# EAGLE design 4StringDriver (EAGLE 7.5.0)
DESIGNER: Ross; VERSION: 1.0a
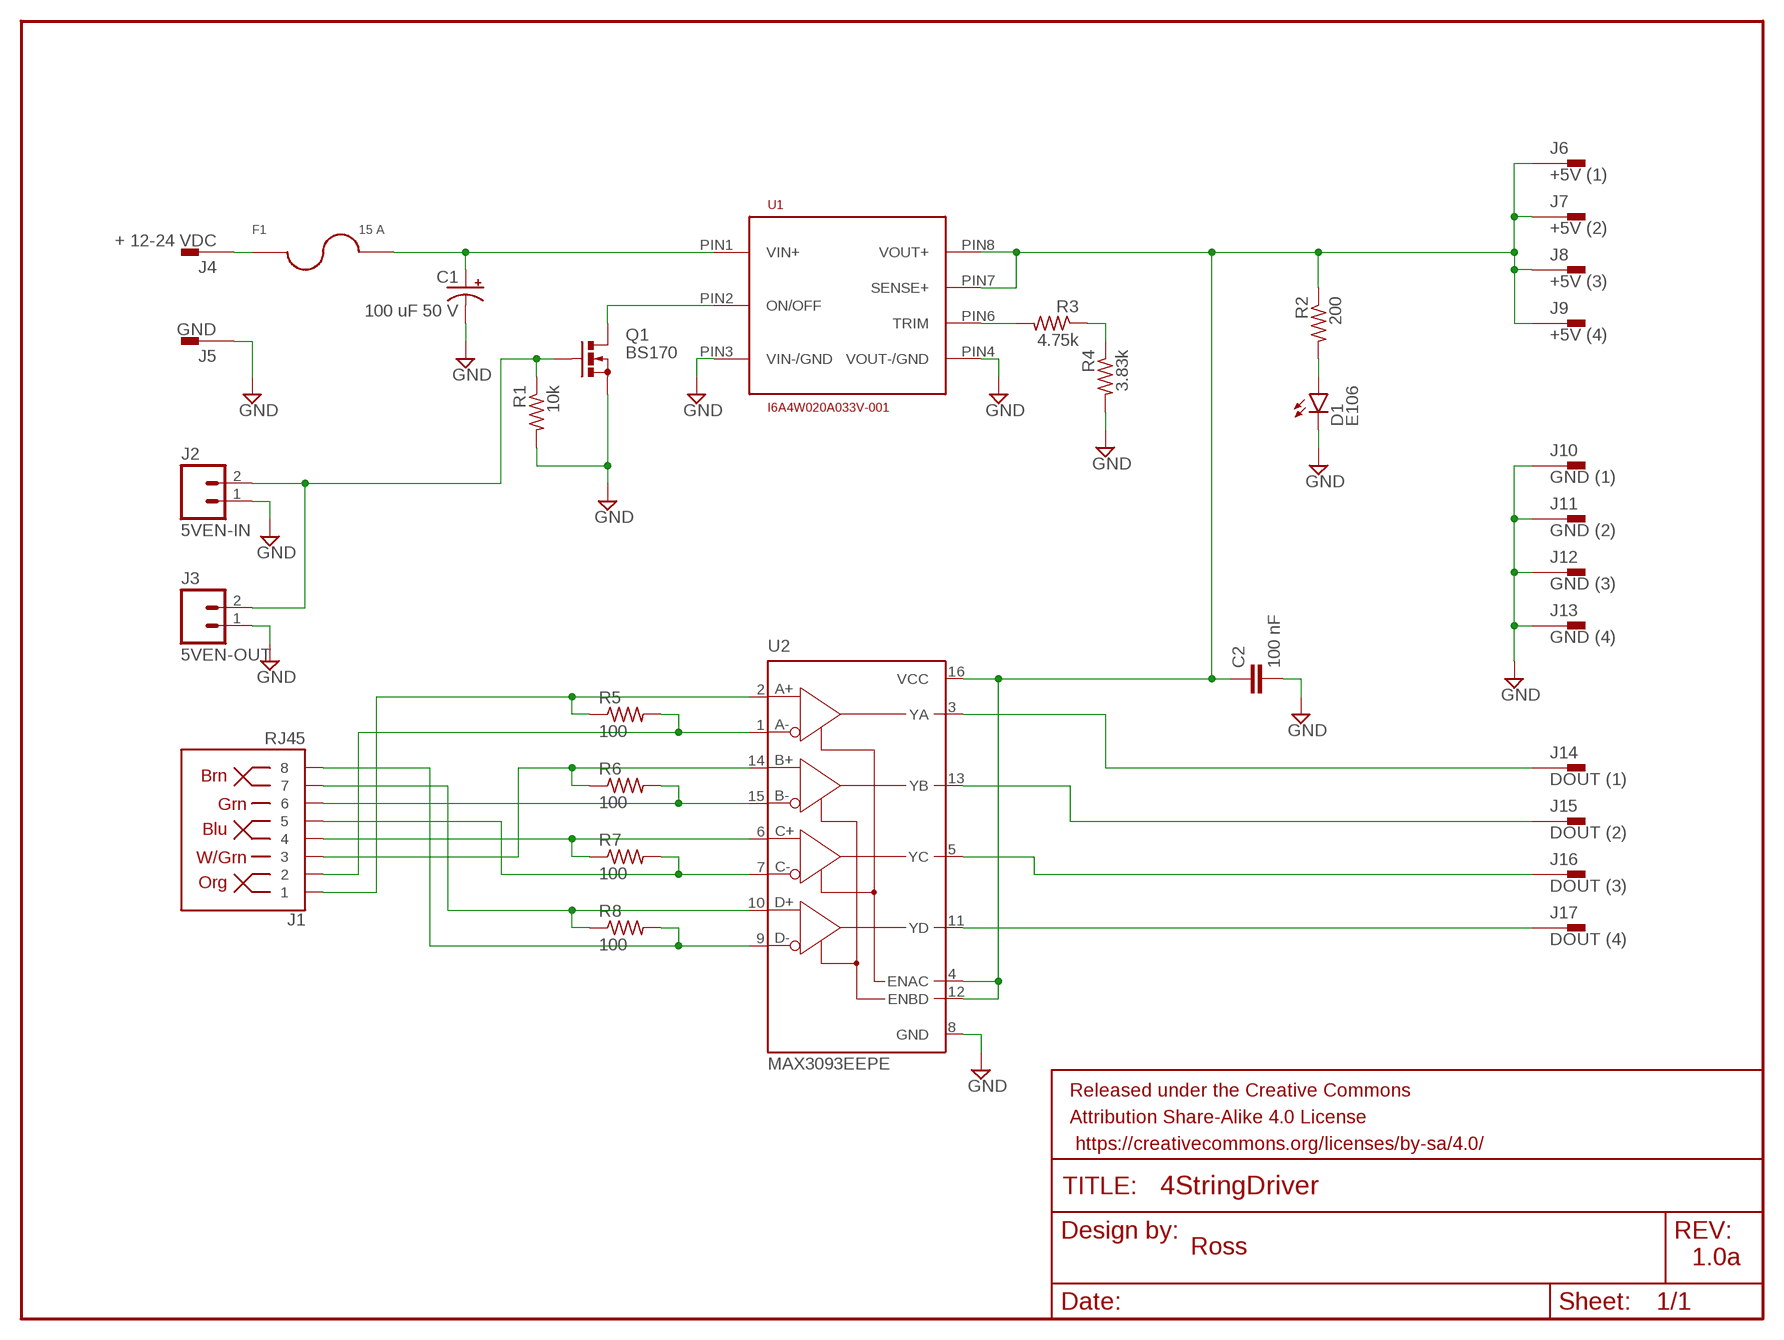
[diagram p0: schematic, sheet 1]

## Parts
C1  100 uF 50 V  CPOL-USE5-10.5  [E5-10,5]
C2  100 nF  0.1UF-50V-20%(PTH)KIT-EZ  [CAP-PTH-SMALL-KIT]
D1  E106  LED3MM  [LED3MM]
F1  15 A  FUSE-ATM  [FUSE-ATM]
FRAME1  FRAME-LETTER  [CREATIVE_COMMONS]
J1  RJ45  RJ45-8PTH  [RJ45-8]
J2  5VEN-IN  M02JST-PTH-VERT  [JST-2-PTH-VERT]
J3  5VEN-OUT  M02JST-PTH-VERT  [JST-2-PTH-VERT]
J4  + 12-24 VDC  PIN2F061.100  [F061.100]
J5  GND  PIN2F061.100  [F061.100]
J6  +5V (1)  PIN2F061.100  [F061.100]
J7  +5V (2)  PIN2F061.100  [F061.100]
J8  +5V (3)  PIN2F061.100  [F061.100]
J9  +5V (4)  PIN2F061.100  [F061.100]
J10  GND (1)  PIN2F061.100  [F061.100]
J11  GND (2)  PIN2F061.100  [F061.100]
J12  GND (3)  PIN2F061.100  [F061.100]
J13  GND (4)  PIN2F061.100  [F061.100]
J14  DOUT (1)  PIN2F061.100  [F061.100]
J15  DOUT (2)  PIN2F061.100  [F061.100]
J16  DOUT (3)  PIN2F061.100  [F061.100]
J17  DOUT (4)  PIN2F061.100  [F061.100]
Q1  BS170  [SOT54E]
R1  10k  R-US_0204/7  [0204/7]
R2  200  R-US_0204/7  [0204/7]
R3  4.75k  R-US_0204/7  [0204/7]
R4  3.83k  R-US_0204/7  [0204/7]
R5  100  R-US_R0603  [R0603]
R6  100  R-US_R0603  [R0603]
R7  100  R-US_R0603  [R0603]
R8  100  R-US_R0603  [R0603]
U1  I6A4W020A033V-001  [16TH-BRICK-POWER-MODULE-NO-OPTIONS]
U2  MAX3093EEPE  [DIL16]

## Nets
5VEN: J2.2 J3.2 Q1.G R1.1
+5V: C2.1 J6.A1 J6.A2 J7.A1 J7.A2 J8.A1 J8.A2 J9.A1 J9.A2 R2.1 U1.PIN7(SENSE+) U1.PIN8(VOUT+) U2.4(ENAC) U2.12(ENBD) U2.16(VCC)
DA+: J1.1 R5.1 U2.2(A+)
DA-: J1.2 R5.2 U2.1(A-)
DB+: J1.3 R6.1 U2.14(B+)
DB-: J1.6 R6.2 U2.15(B-)
DC+: J1.4 R7.1 U2.6(C+)
DC-: J1.5 R7.2 U2.7(C-)
DD+: J1.7 R8.1 U2.10(D+)
DD-: J1.8 R8.2 U2.9(D-)
DOUT1: J14.A1 J14.A2 U2.3(YA)
DOUT2: J15.A1 J15.A2 U2.13(YB)
DOUT3: J16.A1 J16.A2 U2.5(YC)
DOUT4: J17.A1 J17.A2 U2.11(YD)
GND: C1.- C2.2 D1.K(C) J2.1 J3.1 J5.A1 J5.A2 J10.A1 J10.A2 J11.A1 J11.A2 J12.A1 J12.A2 J13.A1 J13.A2 Q1.S R1.2 R4.2 U1.PIN3(VIN-/GND) U1.PIN4(VOUT-/GND) U2.8(GND)
N$2: Q1.D U1.PIN2(ON/OFF)
N$4: D1.A R2.2
N$5: R3.2 U1.PIN6(TRIM)
N$6: R3.1 R4.1
VIN+: F1.PAD1 F1.PAD2 J4.A1 J4.A2
VIN+FUSED: C1.+ F1.PAD3 F1.PAD4 U1.PIN1(VIN+)

## Library data of the parts
C1 = rcl:CPOL-US: POLARIZED CAPACITOR, American symbol
C2 = SparkFun-Capacitors:0.1UF-50V-20%(PTH): CAP-08370; PROD_ID: CAP-08370
D1 = SparkFun-LED:LED: LEDs Standard schematic elements and footprints for 5mm, 3mm, 1206, and 0603 sized LEDs. 5mm - Spark Fun Electronics SKU : COM-00529 (and others); PROD_ID: DIO-08794
F1 = skipzone:FUSE-ATM
FRAME1 = SparkFun-Aesthetics:FRAME-LETTER: Schematic Frame Standard 8.5x11 US Letter frame
J1 = SparkFun-Connectors:RJ45-8: RJ45 Jack Simple RJ45, 8-pin connection - connector for common Cat5, Cat5e, and Cat6 Ethernet cables. Footprint not yet proven in production. Connector sku is PRT-00643; Breakout PCB sku is BOB-00716.; PROD_ID: CONN-08506
J2 J3 = SparkFun-Connectors:M02: Standard 2-pin 0.1" header. Use with - straight break away headers ( PRT-00116) - right angle break away headers (PRT-00553) - swiss pins (PRT-00743) - machine pins (PRT-00117) - female headers (PRT-00115) Molex polarized connector foot print use with: PRT-08233 with associated crimp pins and housings. 2.54_SCREWTERM for use with PRT-10571. 3.5mm Screw Terminal footprints for PRT-08084 5mm Screw Terminal footprints for use with PRT-08432
J4-J17 = con-faston:PIN2: Flachstecker Typ Tyco/Electronics/AMP TAB, FASTON Printed Circuit Board Tabs Source: http://www.buerklin.com, http://catalog.tycoelectronics.com; OC_FARNELL: unknown; OC_NEWARK: unknown
Q1 = transistor-small-signal:BS170: N-CHANNEL MOS FET
R1-R8 = rcl:R-US_: RESISTOR, American symbol
U1 = skipzone:I6A4W020A033V-001: TDK-Lambda i6A Series DC/DC Power Module 9-53V input; 3.3-15V, 20A, 250W output 1/16th brick feature set 001: negative-logic on/off
U2 = skipzone:MAX309*: ±15kV ESD-Protected, 10Mbps, 3V/5V, Quad RS-422/RS-485 Receivers Source: http://pdfserv.maxim-ic.com/en/ds/MAX3095-MAX3096.pdf; MF: MAXIM; MPN: MAX3093EE+

## Board
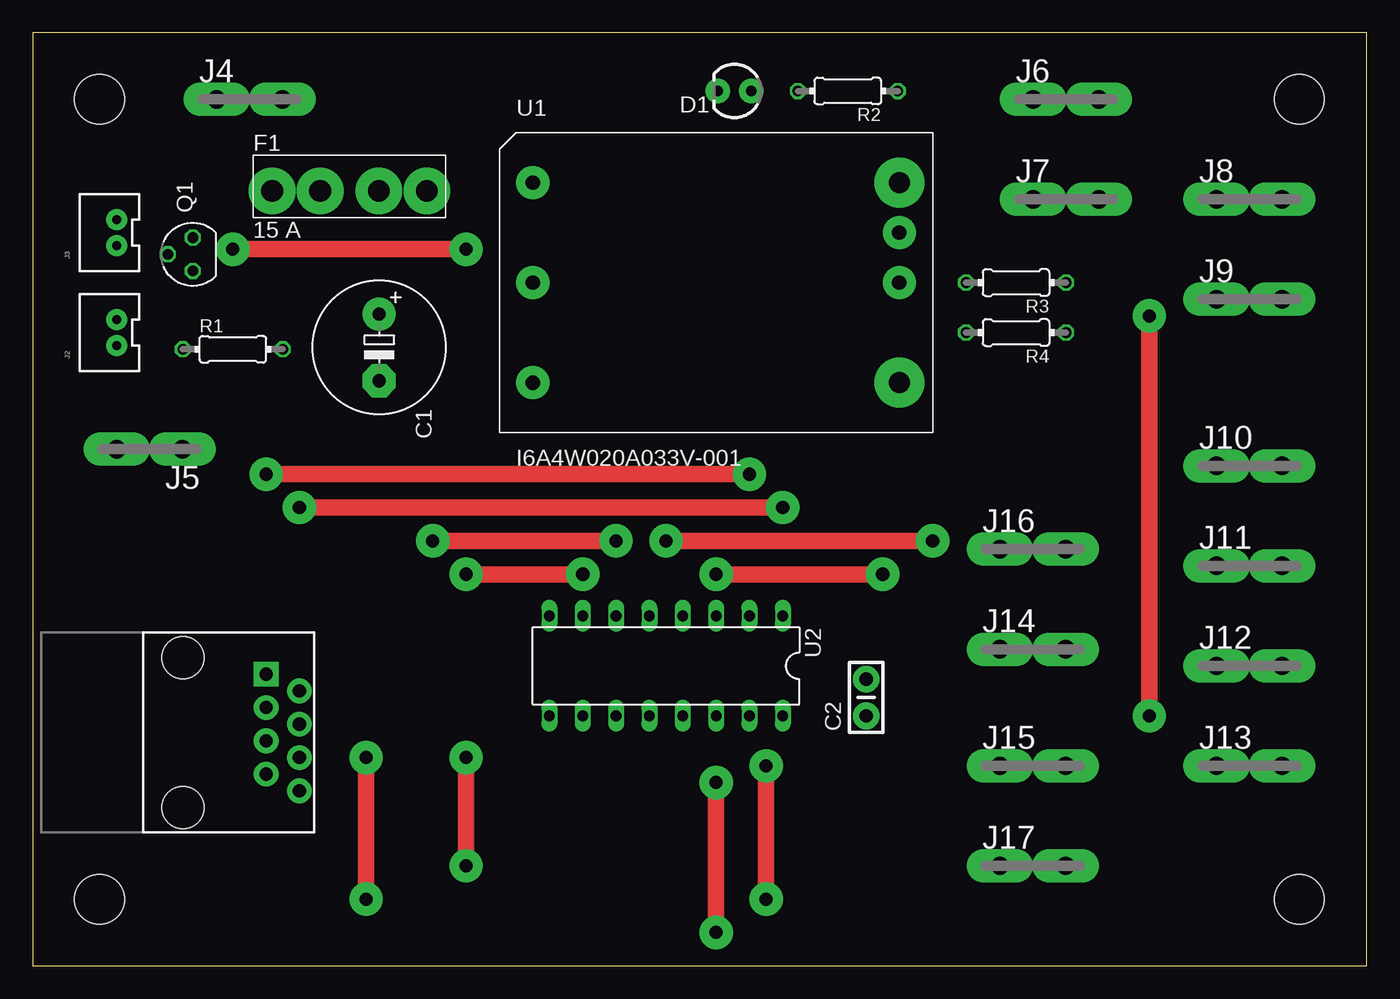
[diagram p1: board, top side]
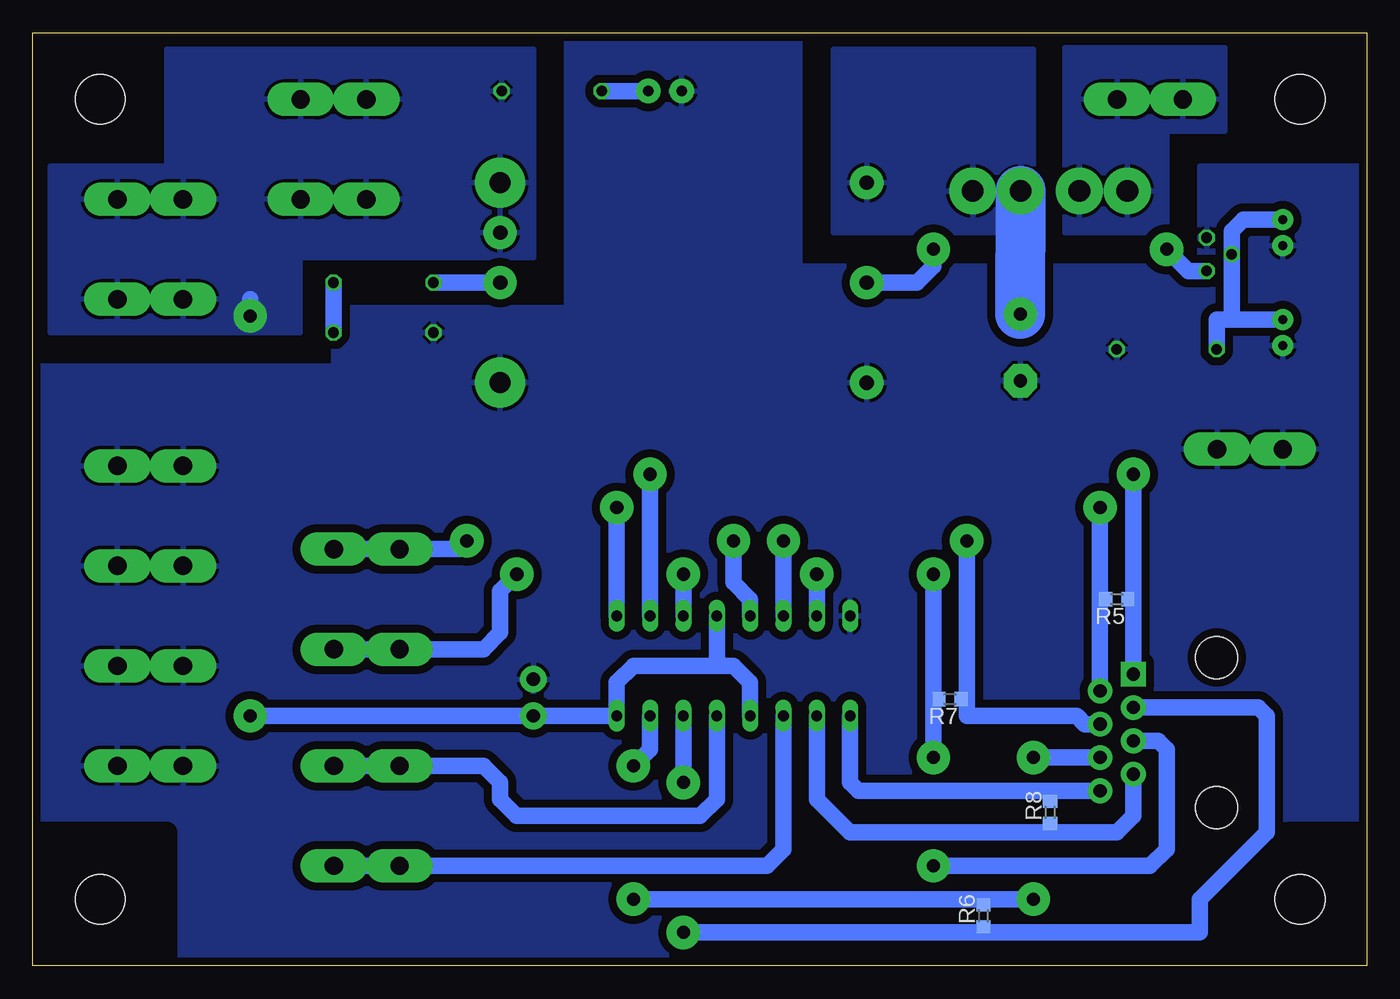
[diagram p2: board, bottom side, seen from below]

Size 101.65 x 71.11 mm. Coordinates in mm from the lower left corner, seen from the top.
Outline: 0,0 101.65,0 101.65,71.11 0,71.11 0,0
Copper layers (1*16): Top 0.035559375mm / dielectric 1.6mm / Bottom 0.035559375mm
Design rules "oshpark-2layer": minimum track width 6mil, minimum drill 10mil, track to track 6mil, track to pad 6mil, pad to pad 6mil, via to via 6mil, smd to smd 6mil, copper to edge 15mil, drill to drill 6mil, minimum pad ring 5mil, minimum via ring 5mil, stop-mask expansion 2.5mil, vias tented up to drill 0mil, thermal gap 10mil
Holes 3.8 mm at 5.08,66.04 5.08,5.08 96.52,5.08 96.52,66.04
bRestrict: area 0,0 to 11.4,10.2; area 91.4,0 to 101.6,10.2

### Footprints (pad centres in the part's own frame; a part is rotated, then mirrored left to right if it is on the bottom)
E5-10,5 = drill 1.016 pad 2.54: + -2.54,0 | drill 1.016 pad 2.54 octagon: - 2.54,0
CAP-PTH-SMALL-KIT = drill 1.016 pad 2.032: 1 -1.397,0; 2 1.397,0
LED3MM = drill 0.813 pad 1.88: A -1.27,0; K 1.27,0
FUSE-ATM = drill 1.651 pad 3.556: PAD1 -5.893,0; PAD2 -2.235,0; PAD3 2.235,0; PAD4 5.893,0
RJ45-8 = drill 1 pad 1.88 square: 1 -4.445,6.35 | drill 1 pad 1.88: 2 -3.175,8.89; 3 -1.905,6.35; 4 -0.635,8.89; 5 0.635,6.35; 6 1.905,8.89; 7 3.175,6.35; 8 4.445,8.89 | hole 3.2: -5.715,0; 5.715,0
JST-2-PTH-VERT = drill 0.7 pad 1.6: 1 -1,-0.55; 2 1,-0.55
F061.100 = drill 1.4 pad 2.54 long: A1 -2.5,0; A2 2.5,0
SOT54E = drill 0.813 octagon: D -1.27,0; G 0,1.905; S 1.27,0
0204/7 = drill 0.813 octagon: 1 -3.81,0; 2 3.81,0
R0603 = smd 1 x 1.1: 1 -0.85,0; 2 0.85,0
16TH-BRICK-POWER-MODULE-NO-OPTIONS = drill 1.1 pad 2.54: PIN1 -13.97,7.62; PIN2 -13.97,0; PIN3 -13.97,-7.62; PIN6 13.97,0; PIN7 13.97,3.81 | drill 1.6 pad 3.81: PIN4 13.97,-7.62; PIN8 13.97,7.62
DIL16 = drill 0.813 long: 1 -8.89,-3.81; 2 -6.35,-3.81; 3 -3.81,-3.81; 4 -1.27,-3.81; 5 1.27,-3.81; 6 3.81,-3.81; 7 6.35,-3.81; 8 8.89,-3.81; 9 8.89,3.81; 10 6.35,3.81; 11 3.81,3.81; 12 1.27,3.81; 13 -1.27,3.81; 14 -3.81,3.81; 15 -6.35,3.81; 16 -8.89,3.81

### Placement (x,y rotation side)
C1  26.39,47.13 270 top
C2  63.5,20.45 90 top
D1  53.47,66.67 180 top
F1  24.13,59.05 0 top
FRAME1  21.59,-7.62 0 top  (outside the outline)
J1  11.43,17.78 270 top
J2  5.84,48.26 90 top
J3  5.84,55.88 90 top
J4  16.51,66.04 0 top
J5  8.89,39.37 180 top
J6  78.74,66.04 0 top
J7  78.74,58.42 0 top
J8  92.71,58.42 0 top
J9  92.71,50.8 0 top
J10  92.71,38.1 0 top
J11  92.71,30.48 0 top
J12  92.71,22.86 0 top
J13  92.71,15.24 0 top
J14  76.2,24.13 0 top
J15  76.2,15.24 0 top
J16  76.2,31.75 0 top
J17  76.2,7.62 0 top
Q1  12.19,54.23 90 top
R1  15.24,46.99 0 top
R2  62.1,66.67 180 top
R3  74.93,52.07 180 top
R4  74.93,48.26 180 top
R5  19.05,27.94 180 bottom
R6  29.21,3.81 90 bottom
R7  31.75,20.32 180 bottom
R8  24.13,11.68 90 bottom
U1  52.07,52.07 0 top
U2  48.26,22.86 180 top

### Tracks (layer width: path | path; a pad name or v marks a point on that pad's centre or on a via)
5VEN
  Bottom 1.27: R1.1 11.43,49.26 10.29,49.26 | 10.29,49.26 Q1.G 10.29,56.01 9.41,56.88 J3.2 | J2.2 10.29,49.26
+5V  (via drill 1 pad 2.54)
  Top 1.27: v85.09,19.05 v85.09,49.53
  Bottom 1.27: U2.12 46.99,21.59 48.26,22.86 49.53,22.86 | 49.53,22.86 55.88,22.86 57.15,21.59 U2.16 C2.1 v85.09,19.05 | U2.4 49.53,22.86 | v85.09,49.53 85.09,50.8
  pour Bottom (isolate 0.61): 63.5,53.98 63.5,69.85 91.44,69.85 91.44,60.96 100.33,60.96 100.33,48.26 81.28,48.26 81.28,53.98
DA+  (via drill 1 pad 2.54)
  Top 1.27: v54.61,37.47 v17.78,37.47
  Bottom 0.61: R5.1 17.78,27.94
  Bottom 1.27: U2.2 v54.61,37.47 | v17.78,37.47 17.78,27.94 J1.1
DA-  (via drill 1 pad 2.54)
  Top 1.27: v57.15,34.92 v20.32,34.92
  Bottom 0.61: R5.2 20.32,27.94
  Bottom 1.27: U2.1 v57.15,34.92 | v20.32,34.92 20.32,27.94 J1.2
DB+  (via drill 1 pad 2.54)
  Top 1.27: v52.07,2.54 v52.07,13.97
  Bottom 0.61: R6.1 30.48,2.54
  Bottom 1.27: J1.3 8.26,19.68 7.62,19.05 7.62,10.16 12.7,5.08 12.7,2.54 30.48,2.54 v52.07,2.54 | v52.07,13.97 U2.14
DB-  (via drill 1 pad 2.54)
  Top 1.27: v25.4,15.88 v25.4,5.08 | v55.88,5.08 v55.88,15.24
  Bottom 0.61: R6.2 30.48,5.08
  Bottom 1.27: J1.6 v25.4,15.88 | v25.4,5.08 30.48,5.08 v55.88,5.08 | v55.88,15.24 54.61,16.51 U2.15
DC+  (via drill 1 pad 2.54)
  Top 1.27: v44.45,32.38 v30.48,32.38
  Bottom 0.61: R7.1 30.48,20.32
  Bottom 1.27: v30.48,32.38 30.48,20.32 30.48,19.05 22.1,19.05 21.46,18.41 J1.4 | U2.6 v44.45,32.38
DC-  (via drill 1 pad 2.54)
  Top 1.27: v33.02,7.62 v33.02,15.88 | v41.91,29.84 v33.02,29.84
  Bottom 0.61: R7.2 33.02,20.32
  Bottom 1.27: J1.5 15.88,17.14 15.24,16.51 15.24,8.89 16.51,7.62 v33.02,7.62 | v33.02,15.88 33.02,20.32 v33.02,29.84 | U2.7 v41.91,29.84
DD+
  Bottom 0.61: R8.1 24.13,10.16
  Bottom 1.27: J1.7 17.78,11.43 19.05,10.16 24.13,10.16 39.37,10.16 41.91,12.7 U2.10
DD-
  Bottom 0.61: R8.2 24.13,13.34
  Bottom 1.27: J1.8 24.13,13.34 38.73,13.34 39.37,13.97 U2.9
DOUT1  (via drill 1 pad 2.54)
  Top 1.27: v52.07,29.84 v64.77,29.84
  Bottom 1.27: U2.3 v52.07,29.84 | v64.77,29.84 66.04,28.57 66.04,25.4 67.31,24.13 J14.A1 J14.A2
DOUT2
  Bottom 1.27: U2.13 49.53,12.7 50.8,11.43 64.77,11.43 66.04,12.7 66.04,13.97 67.31,15.24 J15.A1 J15.A2
DOUT3  (via drill 1 pad 2.54)
  Top 1.27: v48.26,32.38 v68.58,32.38
  Bottom 1.27: U2.5 46.99,27.94 48.26,29.21 v48.26,32.38 | v68.58,32.38 69.22,31.75 J16.A1 J16.A2
DOUT4
  Bottom 1.27: U2.11 44.45,8.89 45.72,7.62 J17.A1 J17.A2
GND
  pour Bottom (isolate 0.61): 0,0 0,60.96 12.7,60.96 12.7,53.34 43.18,53.34 43.18,71.12 60.96,71.12 60.96,50.16 78.74,50.16 78.74,45.72 101.6,45.72 101.6,0
N$2  (via drill 1 pad 2.54)
  Top 1.27: v15.24,54.61 v33.02,54.61
  Bottom 1.27: Q1.D 13.59,52.96 v15.24,54.61 | v33.02,54.61 33.02,53.34 34.29,52.07 U1.PIN2
N$4
  Bottom 1.27: D1.A R2.2
N$5
  Bottom 1.27: U1.PIN6 R3.2
N$6
  Bottom 1.27: R3.1 R4.1
VIN+
  pour Bottom (isolate 0.61): 10.79,69.98 22.99,69.98 22.99,55.88 15.24,55.88 15.24,63.63 10.79,63.63
VIN+FUSED
  Bottom 3.81: C1.+ F1.PAD3
  pour Bottom (isolate 0.61): 40.64,55.88 25.4,55.88 25.4,69.85 40.64,69.85